# EAGLE design esp8266mosfet (EAGLE 7.5.0)
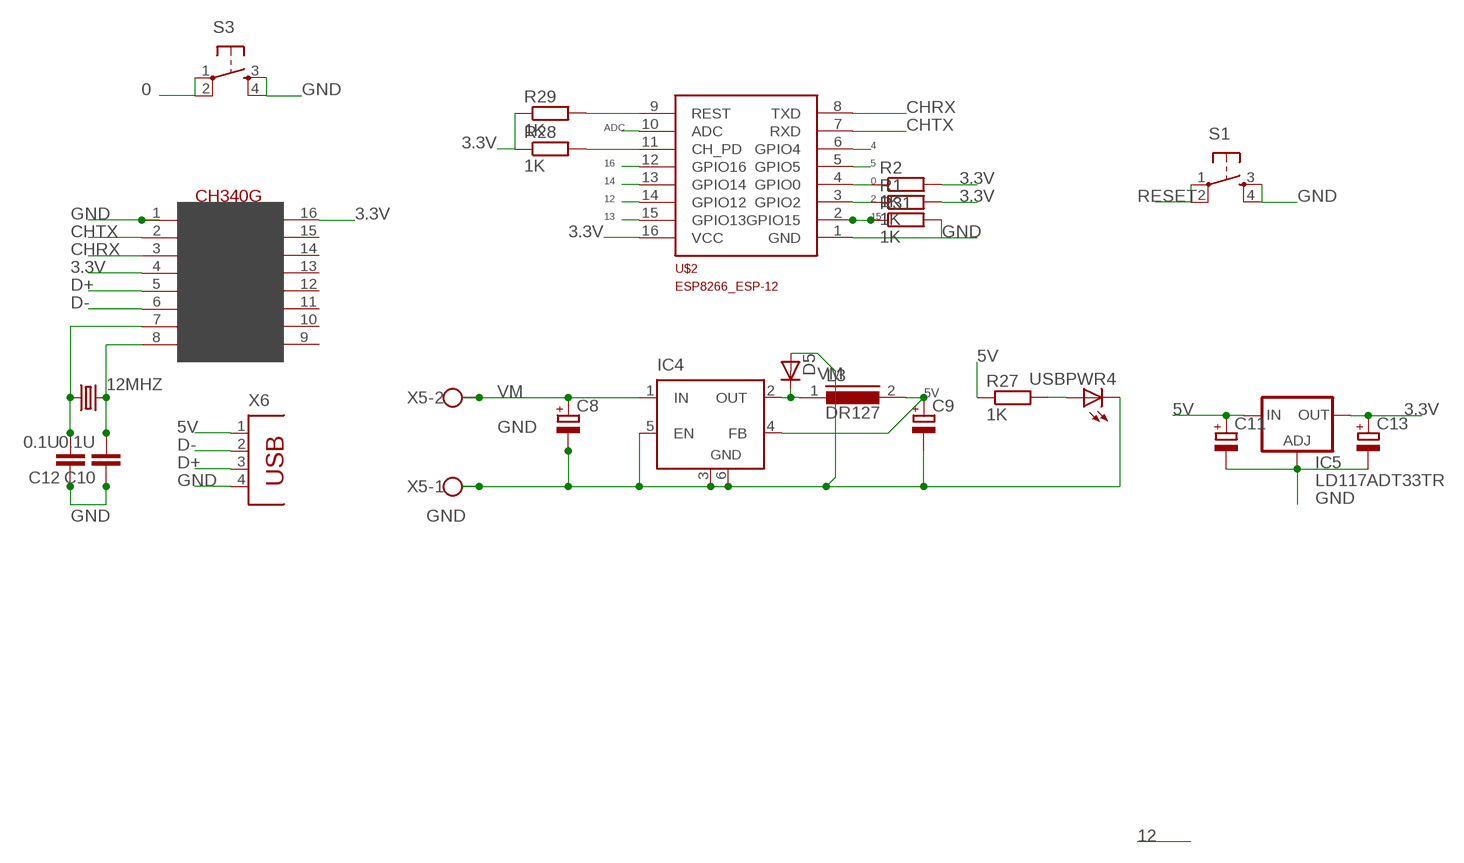
[diagram p0: schematic, sheet 1]

## Parts
12MHZ  CRYSTALHC49UP  [HC49UP]
C8  CPOL-EUE  [PANASONIC_E]
C9  CPOL-EUE  [PANASONIC_E]
C10  0.1U  C-EUC1206  [C1206]
C11  CPOL-EUC  [PANASONIC_C]
C12  0.1U  C-EUC1206  [C1206]
C13  CPOL-EUC  [PANASONIC_C]
D5  D-SOD-87  [SOD87]
IC4  LM2596S  [TO263-5]
IC5  LD117ADT33TR  [DPACK]
L3  DR127  [DR127]
R1  1K  R-EU_M1206  [M1206]
R2  1K  R-EU_M1206  [M1206]
R27  1K  R-EU_M1206  [M1206]
R28  1K  R-EU_M1206  [M1206]
R29  1K  R-EU_M1206  [M1206]
R31  1K  R-EU_M1206  [M1206]
S1  TAC_SWITCHPTH  [TACTILE-PTH]
S3  TAC_SWITCHPTH  [TACTILE-PTH]
U$2  ESP8266_ESP-12  [ESP8266-ESP12]
U$4  CH340G  [SOIC16]
USBPWR4  LED3MM  [LED3MM]
X5  W237-102  [W237-102]
X6  PN61729  [PN61729]

## Nets
0: R2.1 S3.1 S3.2 U$2.4(GPIO0)
2: R1.1 U$2.3(GPIO2)
3.3V: C13.+ IC5.4(OUT) R1.2 R2.2 R28.1 R29.1 U$2.16(VCC) U$4.4(V3) U$4.16(VCC)
4: U$2.6(GPIO4)
5: U$2.5(GPIO5)
5V: C9.+ C11.+ IC4.4(FB) IC5.3(IN) L3.2 R27.1 X6.1
12: U$2.14(GPIO12)
13: U$2.15(GPIO13)
14: U$2.13(GPIO14)
15: R31.1 U$2.2(GPIO15)
16: U$2.12(GPIO16)
ADC: U$2.10(ADC)
CHRX: U$2.8(TXD) U$4.3(RX)
CHTX: U$2.7(RXD) U$4.2(TX)
D+: U$4.5(D+) X6.3
D-: U$4.6(D-) X6.2
GND: C8.- C9.- C10.1 C11.- C12.1 C13.- D5.2(A) IC4.3(GND) IC4.5(EN) IC4.6(GND) IC5.1(ADJ) R31.2 S1.3 S1.4 S3.3 S3.4 U$2.1(GND) U$4.1(GND) USBPWR4.K(C) X5.1 X6.4
N$9: D5.1(C) IC4.2(OUT) L3.1
N$10: R27.2 USBPWR4.A
N$12: 12MHZ.1 C12.2 U$4.7(XI)
N$13: 12MHZ.2 C10.2 U$4.8(XO)
N$18: R28.2 U$2.11(CH_PD)
RESET: R29.2 S1.1 S1.2 U$2.9(REST)
VM: C8.+ IC4.1(IN) X5.2
Unconnected: U$4.9(CTS) U$4.10(DSR) U$4.11(RI) U$4.12(DCD) U$4.13(DTR) U$4.14(RTS) U$4.15(RS232)

## Library data of the parts
12MHZ = crystal:CRYSTAL: CRYSTAL; OC_FARNELL: unknown; OC_NEWARK: unknown
C8 C9 = resistor:CPOL-EU: POLARIZED CAPACITOR, European symbol
C10 C12 = rcl:C-EU: CAPACITOR, European symbol
C11 C13 = rcl:CPOL-EU: POLARIZED CAPACITOR, European symbol
D5 = semicon-smd-ipc:D-: DIODE unfilled
IC4 = linear:LM2596S: STEP-DOWN VOLTAGE REGULATOR
IC5 = v-reg:LD117A?*: Low drop fixed and adjustable positive voltage regulators 1 A Source: http://www.st.com/stonline/products/literature/ds/7194/ld1117axx.pdf
L3 = inductors:DR127: High Power Density, High Efficiency, Shielded Inductors Source: coiltronics_dr_series.pdf
R1 R2 R27-R29 R31 = rcl:R-EU_: RESISTOR, European symbol
S1 S3 = SparkFun:TAC_SWITCH: Momentary Switch Button commonly used for reset or general input. Spark Fun Electronics SKU : COM-00097
U$2 = ESP8266-ESP12:ESP8266_ESP-12: ESP8266 ESP-12 Discussion about pins here: http://www.esp8266.com/viewtopic.php?f=13&t=1429
U$4 = usb-serial:CH340G
USBPWR4 = RepRapjr:LED: LED OSRAM: - CHIPLED LG R971, LG N971, LY N971, LG Q971, LY Q971, LO R971, LY R971 LH N974, LH R974 LS Q976, LO Q976, LY Q976 LO Q996 - Hyper CHIPLED LW Q18S LB Q993, LB Q99A, LB R99A - SideLED LS A670, LO A670, LY A670, LG A670, LP A670 LB A673, LV A673, LT A673, LW A673 LH A674 LY A675 LS A676, LA A676, LO A676, LY A676, LW A676 LS A679, LY A679, LG A679 - Hyper Micro SIDELED® LS Y876, LA Y876, LO Y876, LY Y876 LT Y87S - SmartLED LW L88C, LW L88S LB L89C, LB L89S, LG L890 LS L89K, LO L89K, LY L89K LS L896, LA L896, LO L896, LY L896 - TOPLED LS T670, LO T670, LY T670, LG T670, LP T670 LSG T670, LSP T670, LSY T670, LOP T670, LYG T670 LG T671, LOG T671, LSG T671 LB T673, LV T673, LT T673, LW T673 LH T674 LS T676, LA T676, LO T676, LY T676, LB T676, LH T676, LSB T676, LW T676 LB T67C, LV T67C, LT T67C, LS T67K, LO T67K, LY T67K, LW E67C LS E67B, LA E67B, LO E67B, LY E67B, LB E67C, LV E67C, LT E67C LW T67C LS T679, LY T679, LG T679 LS T770, LO T770, LY T770, LG T770, LP T770 LB T773, LV T773, LT T773, LW T773 LH T774 LS E675, LA E675, LY E675, LS T675 LS T776, LA T776, LO T776, LY T776, LB T776 LHGB T686 LT T68C, LB T68C - Hyper Mini TOPLED® LB M676 - Mini TOPLED Santana® LG M470 LS M47K, LO M47K, LY M47K Source: http://www.osram.convergy.de LUXEON: - LUMILED® LXK2-PW12-R00, LXK2-PW12-S00, LXK2-PW14-U00, LXK2-PW14-V00 LXK2-PM12-R00, LXK2-PM12-S00, LXK2-PM14-U00 LXK2-PE12-Q00, LXK2-PE12-R00, LXK2-PE12-S00, LXK2-PE14-T00, LXK2-PE14-U00 LXK2-PB12-K00, LXK2-PB12-L00, LXK2-PB12-M00, LXK2-PB14-N00, LXK2-PB14-P00, LXK2-PB14-Q00 LXK2-PR12-L00, LXK2-PR12-M00, LXK2-PR14-Q00, LXK2-PR14-R00 LXK2-PD12-Q00, LXK2-PD12-R00, LXK2-PD12-S00 LXK2-PH12-R00, LXK2-PH12-S00 LXK2-PL12-P00, LXK2-PL12-Q00, LXK2-PL12-R00 Source: www.luxeon.com KINGBRIGHT: KA-3528ASYC Source: www.kingbright.com
X5 = con-wago-500:W237-102: WAGO SCREW CLAMP; MPN: 237-102; OC_FARNELL: unknown; OC_NEWARK: 70K9898
X6 = con-berg:PN61729: BERG USB connector; OC_FARNELL: unknown; OC_NEWARK: unknown

## Net classes
1 power: width 0.6 mm, clearance 0.305 mm

## Board
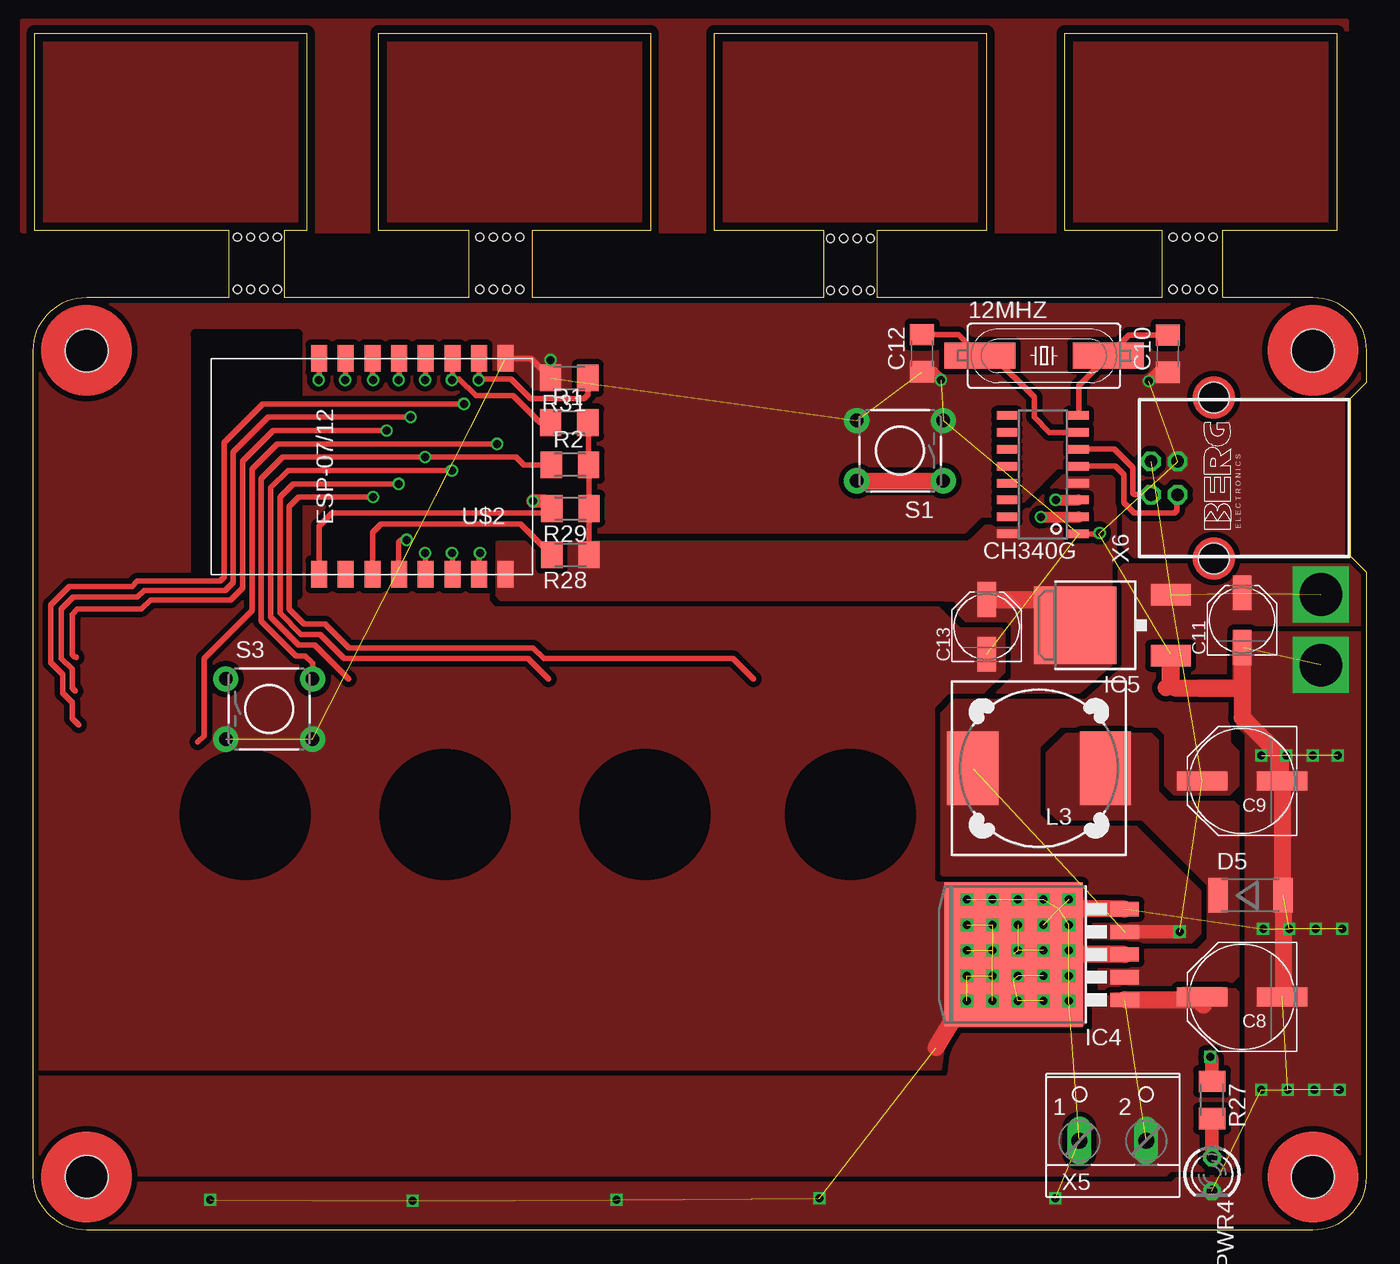
[diagram p1: board, top side]
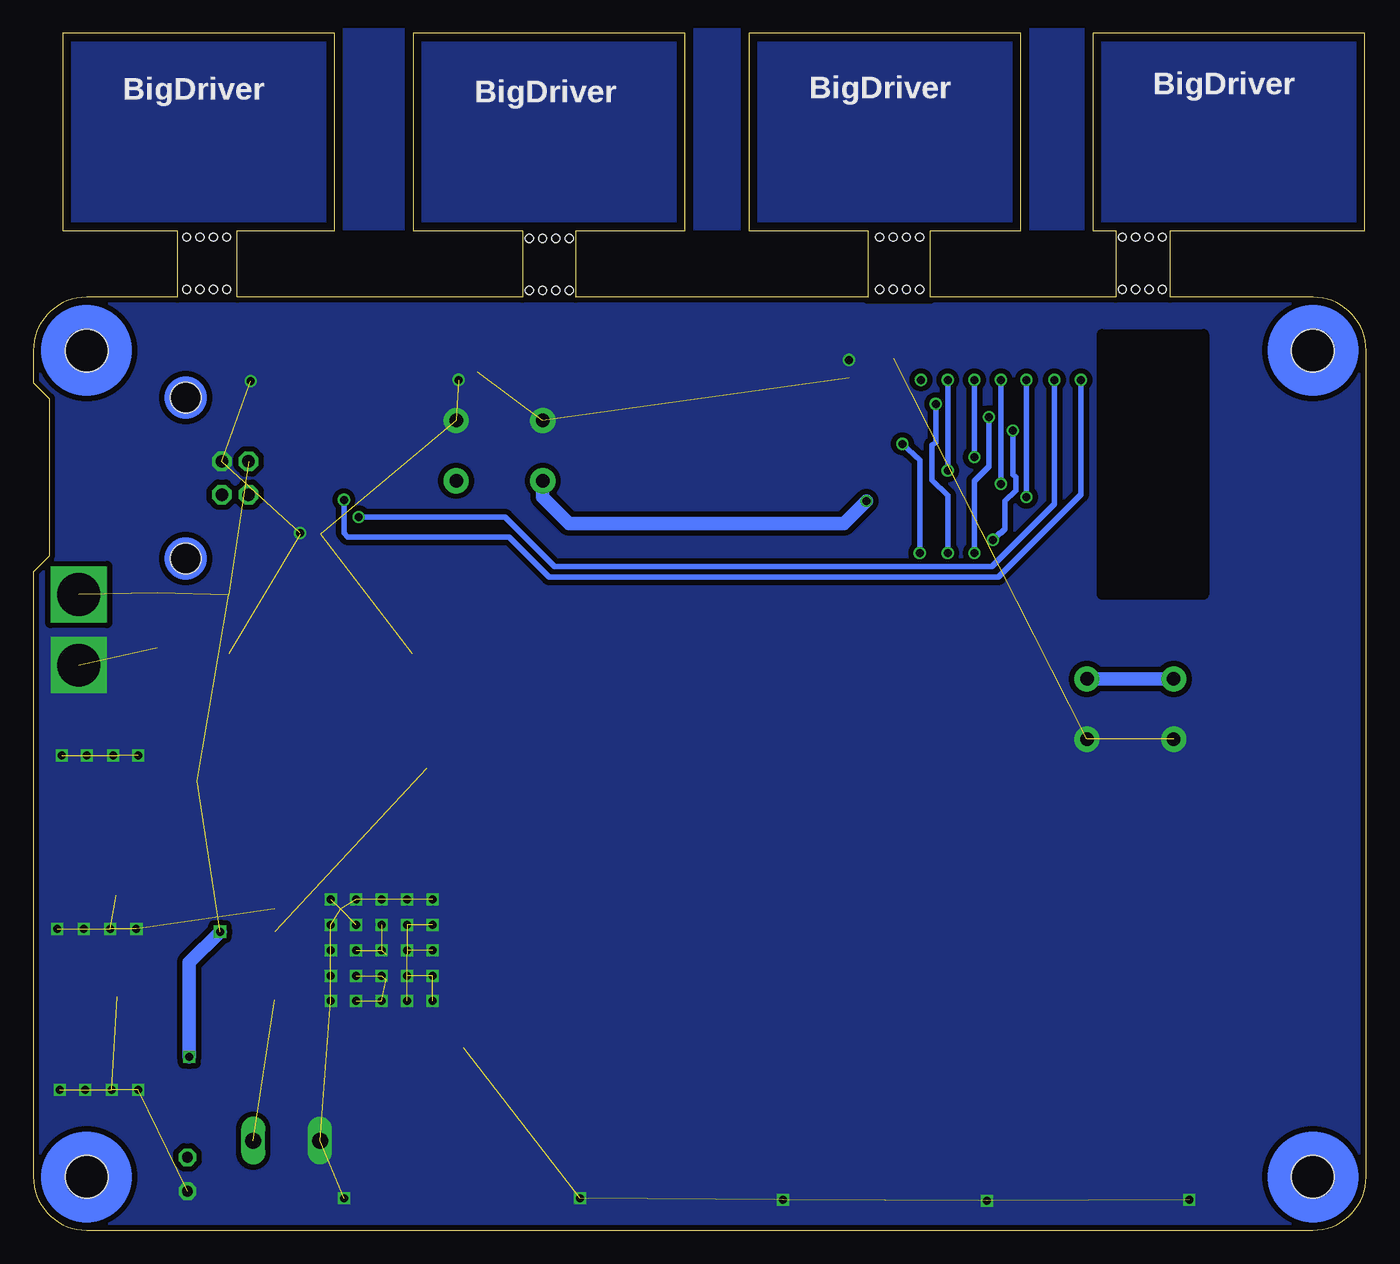
[diagram p2: board, bottom side, seen from below]

Size 100 x 89.8 mm. Coordinates in mm from the lower left corner, seen from the top.
Outline: 0,4 0,66 arc-90 4,70 14.7,70 14.7,75 0.1,75 0.1,89.8 20.5,89.8 20.5,75 18.8,75 18.8,70 32.7,70 32.7,75 25.9,75 25.9,89.8 46.3,89.8 46.3,75 37.4,75 37.4,70 59.3,70 59.3,75 51.1,75 51.1,89.8 71.5,89.8 71.5,75 63.3,75 63.3,70 84.7,70 84.7,75 77.4,75 77.4,89.8 97.8,89.8 97.8,75 89.2,75 89.2,70 96,70 arc-90 100,66 100,63.6 98.8,62.4 98.8,50.6 100,49.4 100,4 arc-90 96,0 4,0 arc-90 0,4
Copper layers (1*16): Top 0.035mm / dielectric 1.5mm / Bottom 0.035mm
Design rules "dirt_cheap_dirty_boards.v1": minimum track width 5mil, minimum drill 12mil, track to track 5mil, track to pad 5mil, pad to pad 5mil, via to via 5mil, smd to smd 0mil, copper to edge 10mil, drill to drill 10mil, minimum pad ring 10mil, minimum via ring 6mil, stop-mask expansion 2mil, vias tented up to drill 25mil, thermal gap 10mil
Holes 3.2 mm at 4,4 96,4 4,66 96,66
Holes 0.6 mm at 15.3,74.5 16.3,74.5 17.3,74.5 18.3,74.5 15.3,70.6 16.3,70.6 17.3,70.6 18.3,70.6 33.5,74.5 34.5,74.5 35.5,74.5 36.5,74.5 33.5,70.6 34.5,70.6 35.5,70.6 36.5,70.6 59.8,74.4 60.8,74.4 61.8,74.4 62.8,74.4 59.8,70.5 60.8,70.5 61.8,70.5 62.8,70.5 85.5,74.5 86.5,74.5 87.5,74.5 88.5,74.5 85.5,70.6 86.5,70.6 87.5,70.6 88.5,70.6
tRestrict: area 12.2,47.7 to 19.8,67.2; area 14.7,70 to 18.8,75; area 32.7,70 to 37.4,75; area 59.3,70 to 63.3,75; area 84.7,70 to 89.2,75; area -25.8,39.8 to -19.8,45.8; area 58.3,28.2 to 64.3,34.2; area 42.9,28.2 to 48.9,34.2; area 27.9,28.2 to 33.9,34.2; area 12.9,28.2 to 18.9,34.2
bRestrict: area 12.2,47.7 to 19.8,67.2; area 84.7,70 to 89.2,75; area 59.3,70 to 63.3,75; area 32.7,69.9 to 37.4,75; area 14.7,70 to 18.8,75

### Footprints (pad centres in the part's own frame; a part is rotated, then mirrored left to right if it is on the bottom)
HC49UP = smd 5.334 x 1.93: 1 -4.826,0; 2 4.826,0
PANASONIC_E = smd 3.8 x 1.4: + 3,0; - -3,0
C1206 = smd 1.6 x 1.8: 1 -1.4,0; 2 1.4,0
PANASONIC_C = smd 2.6 x 1.4: + 2.05,0; - -2.05,0
SOD87 = smd 1.45 x 2.6: 1 -2.445,0; 2 2.445,0
TO263-5 = smd 1.067 x 2.159: 1 -3.404,-5.791; 2 -1.702,-5.791; 3 0,-5.791; 4 1.702,-5.791; 5 3.404,-5.791 | smd 10.8 x 10.41: 6 0,2.54
DPACK = smd 1.6 x 3: 1 -2.28,-4.8; 3 2.28,-4.8 | smd 5.8 x 6.2: 4 0,2.38
DR127 = smd 3.85 x 5.5: 1 -4.975,0; 2 4.975,0
M1206 = smd 1.6 x 2: 1 -1.4,0; 2 1.4,0
TACTILE-PTH = drill 1.016 pad 1.88: 1 -3.251,2.261; 2 3.251,2.261; 3 -3.251,-2.261; 4 3.251,-2.261
ESP8266-ESP12 = smd 2 x 1.2: 1 16.2,2; 2 16.2,4; 3 16.2,6; 4 16.2,8; 5 16.2,10; 6 16.2,12; 7 16.2,14; 8 16.2,16; 9 0,16; 10 0,14; 11 0,12; 12 0,10; 13 0,8; 14 0,6; 15 0,4; 16 0,2
SOIC16 = smd 0.635 x 1.524: 1 -4.445,-2.695; 2 -3.175,-2.695; 3 -1.905,-2.695; 4 -0.635,-2.695; 5 0.635,-2.695; 6 1.905,-2.695; 7 3.175,-2.695; 8 4.445,-2.695; 9 4.445,2.695; 10 3.175,2.695; 11 1.905,2.695; 12 0.635,2.695; 13 -0.635,2.695; 14 -1.905,2.695; 15 -3.175,2.695; 16 -4.445,2.695
LED3MM = drill 0.813 octagon: A -1.27,0; K 1.27,0
W237-102 = drill 1.194 long: 1 -2.5,-1.27; 2 2.5,-1.27
PN61729 = drill 0.95 octagon: 1 1.25,4.71; 2 -1.25,4.71; 3 -1.25,2.71; 4 1.25,2.71 | hole 2.3: -6.02,0; 6.02,0

### Placement (x,y rotation side)
12MHZ  75.83,65.61 0 top
C8  90.69,17.51 180 top
C9  90.69,33.7 180 top
C10  85.12,65.76 90 top
C11  90.69,45.77 90 top
C12  66.67,65.8 90 top
C13  71.53,45.27 90 top
D5  91.33,25.13 0 top
IC4  76.09,20.68 90 top
IC5  80.53,45.38 90 top
L3  75.45,34.66 180 top
R1  40.21,60.6 0 top
R2  40.26,57.42 0 top
R27  88.43,9.77 270 top
R28  40.3,50.67 180 top
R29  40.3,54.14 180 top
R31  40.2,63.94 180 top
S1  65.03,58.48 180 top
S3  17.7,39.1 0 top
U$2  37.44,49.21 90 top
U$4  75.73,56.69 90 top
USBPWR4  88.43,4.19 270 top
X5  81,7.99 0 top
X6  88.57,56.43 90 top

### Tracks (layer width: path | path; a pad name or v marks a point on that pad's centre or on a via)
0  (via drill 0.6 pad 0.25)
  Top 0.406: S3.2 20.95,42.55 20.4,43.1 19.7,43.1 17.1,45.7 17.1,56.4 18.7,58 v29.4,58 36.2,58 36.8,57.4 38.83,57.4 R2.1 | U$2.4 29.44,63.84 v29.4,63.8
  Bottom 0.406: v29.4,63.8 v29.4,58
  Bottom 1.016: S3.1 S3.2
2  (via drill 0.6 pad 0.25)
  Top 0.406: 23.64,41.36 21.1,43.9 19.9,43.9 17.8,46 17.8,55.7 19.1,57 v31.4,57 | U$2.3 31.44,63.84 | 31.44,63.84 v31.4,63.8 | 31.44,63.84 31.96,63.84 33.2,62.6 36,62.6 38,60.6 R1.1
  Bottom 0.406: v31.4,63.8 v31.4,57
3.3V
  Top 0.406: 76.22,47.32 IC5.4 | R28.1 R29.1 41.7,57.38 R2.2 41.66,60.55 R1.2
  Top 1.27: C13.+ 76.22,47.32
  pour Top (isolate 0.406, rank 4, no thermals): 34.9,51.6 70.1,51.6 71.3,52.8 73.2,52.8 77,56.6 80.8,56.6 81.2,56.2 81.2,50 81,49.8 81,42.4 78.9,40.3 71.9,40.3 73.2,41.6 73.2,45.2 72.8,45.6 69.8,45.6 69.4,46 69.4,47 69.1,47.3 34.8,47.3 34.8,51.6
4  (via drill 0.6 pad 0.25)
  Top 0.406: 54.04,41.36 52.5,42.9 38.3,42.9 37.5,43.7 23.7,43.7 21.9,45.5 20.3,45.5 19.2,46.6 19.2,54.3 19.9,55 v25.5,55 | U$2.6 25.44,63.86 v25.5,63.8
  Bottom 0.406: v25.5,63.8 v25.5,55
5  (via drill 0.6 pad 0.25)
  Top 0.406: 38.64,41.36 37.1,42.9 23.3,42.9 21.5,44.7 20.1,44.7 18.5,46.3 18.5,55 19.5,56 v27.4,56 | U$2.5 27.44,63.84 v27.4,63.8
  Bottom 0.406: v27.4,63.8 v27.4,56
5V  (via drill 0.6 pad 0.25, 3.2)  (6 unrouted)
  Top 1.016: R27.1 88.43,12.87 v88.3,13 | v86,22.4 81.89,22.4 IC4.4
  Bottom 1.016: v88.3,13 88.3,20.1 v86,22.4
  other vias: 96.6,47.7
  pour Top (isolate 0.406, no thermals): 79.58,23.23 83.07,23.23 83.39,23.54 83.39,24.81 83.07,25.13 79.58,25.13 79.26,25.45 79.26,26.08 78.95,26.4 68.47,26.4 68.15,26.72 68.15,38.78 69.1,39.73 78.95,39.73 81.49,41.96 81.49,49.58 81.8,49.9 100,49.9 100,45.45 90.06,45.45 89.42,44.81 89.42,39.73 89.74,39.42 89.74,36.56 90.38,35.92 90.38,33.38 89.74,32.75 85.61,32.75 84.98,33.38 84.98,37.2 84.34,37.83 77.04,37.83 75.45,36.24 75.45,31.16 76.41,30.21 82.76,30.21 87.52,25.45 87.52,22.27 86.88,21.64 79.58,21.64
12  (via drill 0.6 pad 0.25)
  Top 0.406: 3.39,37.91 2.9,38.4 2.9,39.6 2.2,40.3 2.2,41.7 1.3,42.6 1.3,46.9 2.7,48.3 7.4,48.3 7.8,48.7 14,48.7 14.3,49 14.3,59.1 17.2,62 v32.3,62 | U$2.14 31.44,50.76 v31.4,50.8
  Bottom 0.406: v31.4,50.8 31.4,55.1 32.6,56.3 32.6,58.9 32.3,59.1 v32.3,62
13  (via drill 0.6 pad 0.25)
  Top 0.406: 12.34,36.64 12.8,37.1 12.8,42.9 16.4,46.5 16.4,57.1 18.3,59 v34.8,59 | U$2.15 33.44,50.74 v33.5,50.8
  Bottom 0.406: v33.5,50.8 33.5,57.8 v34.8,59
14  (via drill 0.6 pad 0.25)
  Top 0.406: 3.15,40.45 2.9,40.7 2.9,42.1 2.1,42.9 2.1,46.6 3,47.5 7.8,47.5 8.3,48 14.4,48 15,48.6 15,58.4 17.6,61 v28.3,61 | U$2.13 29.44,50.76 v29.4,50.8
  Bottom 0.406: v29.4,50.8 29.4,56.2 28.3,57.3 v28.3,61
15  (via drill 0.6 pad 0.25)
  Top 0.406: U$2.2 33.44,63.84 | 33.44,63.84 v33.4,63.8 | 33.44,63.84 35.86,63.84 37.3,62.4 41.3,62.4 41.6,62.7 R31.1
16  (via drill 0.6 pad 0.25)
  Top 0.406: 3.21,42.99 3.2,43 3.1,43 2.9,43.2 2.9,46.2 3.3,46.6 8.1,46.6 8.8,47.3 14.8,47.3 15.7,48.2 15.7,57.7 18,60 v26.5,60 | v28,51.8 27.6,51.8 27.4,51.6 27.4,49.25 U$2.12
  Bottom 0.406: v26.5,60 26.5,56.7 26.3,56.5 26.3,55.5 27.1,54.7 27.1,52.6 27.4,52.3 27.5,52.3 v28,51.8
CHRX  (via drill 0.6 pad 0.25)
  Top 0.406: U$2.8 21.44,63.84 v21.4,63.8
  Top 0.813: v76.7,54.8 78.41,54.8 U$4.3
  Bottom 0.406: v21.4,63.8 21.4,55.2 27.6,49 61.3,49 64.3,52 76.4,52 76.7,52.3 v76.7,54.8
CHTX  (via drill 0.6 pad 0.25)
  Top 0.406: U$2.7 23.44,63.94 23.4,63.9 v23.4,63.8
  Top 0.813: v75.6,53.5 78.42,53.5 U$4.2
  Bottom 0.406: v23.4,63.8 23.4,54.5 28.1,49.8 60.9,49.8 64.6,53.5 v75.6,53.5
D+
  Top 0.406: U$4.5 81.18,57.32 81.8,56.7 81.8,54.6 82.6,53.8 85.6,53.8 85.8,54 85.8,55.12 X6.3
D-
  Top 0.406: U$4.6 81.11,58.59 82.5,57.2 82.5,55.3 82.6,55.2 83.84,55.2 X6.2
GND  (via drill 0.6 pad 0.25, 3.2)  (56 unrouted)
  Top 0.406: U$4.1 79.94,52.24 v80,52.3 | U$2.1 37.34,65.41 R31.2 v38.8,65.3
  Top 0.813: C12.1 67.5,64.39 v68.1,63.8 | C10.1 84.36,64.36 v83.7,63.7
  Top 1.27: 84.98,40.69 85.3,41.01 85.3,43.27 IC5.1 85.33,40.97 85.61,40.69 90.38,40.69 90.69,41.01 C11.- 90.69,38.47 93.55,35.61 93.55,33.84 C9.- 93.69,25.21 D5.2 93.77,17.59 C8.- | IC4.6 73.55,18.78 | 67.73,13.7 71.96,20.68 IC4.6 | IC4.3 IC4.6 | IC4.5 76.95,24.09 IC4.6
  Bottom 0.406: v38.8,65.3 38.8,65.6
  other vias: 92.26,22.59 94.23,22.59 96.2,22.59 97.86,35.61 95.99,35.61 94.02,35.61 92.15,35.61 94.12,10.52 92.15,10.52 77.68,24.81 75.77,24.81 73.87,24.81 71.96,24.81 70.06,24.81 70.06,22.91 71.96,22.91 73.87,22.91 75.77,22.91 77.68,22.91 77.68,21 75.77,21 73.87,21 71.96,21 70.06,21 70.06,19.1 71.96,19.1 73.87,19.1 75.77,19.1 77.68,19.1 70.06,17.19 71.96,17.19 73.87,17.19 75.77,17.19 77.68,17.19 28.47,2.2 13.27,2.3 43.77,2.3 58.97,2.4 76.67,2.4 96.12,10.52 98.02,10.52 98.22,22.62 96.6,42.4
  pour Top (isolate 0.406, rank 2, no thermals): -0.95,12.11 68.05,12.11 68.47,15.29 78.63,15.29 78.95,15.61 78.95,25.77 78.63,26.08 68.02,26.08 67.7,26.4 67.7,39 68.9,40.2 71.1,40.2 72.8,41.9 72.8,44.9 72.6,45.1 69.5,45.1 67.9,46.7 34.6,46.7 34.1,47.2 34.1,51.8 34.7,52.4 69.9,52.4 71.1,53.6 73.2,53.6 76.8,57.2 81.3,57.2 81.8,56.7 81.8,51.3 82.6,50.5 98.8,50.5 99.9,51.6 99.9,67.3 97.4,69.8 1.8,69.8 0.4,68.4 0.4,45.1 -0.7,44 -0.95,26.08
  pour Bottom (isolate 0.406, rank 2, no thermals): 100,0 0,0 0,70 100,70
  pour Top (isolate 0.406, rank 5, no thermals): 90.99,4.27 90.97,4.27 90.7,4 85.6,4 85.2,3.6 0.1,3.6 0,3.7 0,0 100,0 100,45.13 88.79,45.13 87.52,43.86 87.52,40.05 89.74,40.05 90.06,39.73 90.06,38.15 91.01,37.2 91.01,4.49
  pour Top (isolate 0.61): -0.8,90.7 98.5,90.7 98.5,75 -0.8,75
  pour Bottom (isolate 0.61): -0.2,90 98.2,90 98.2,75.2 -0.2,75.2
N$9
  pour Top (isolate 0.406, rank 2, no thermals): 79.98,19.73 83.07,19.73 83.39,20.05 83.39,21.32 87.2,21.32 87.84,21.95 87.84,25.77 83.07,30.53 76.72,30.53 75.77,31.48 75.77,35.92 77.04,37.2 84.34,37.2 84.66,36.88 84.66,33.07 85.3,32.43 89.74,32.43 90.38,31.8 90.38,19.1 89.74,18.46 83.39,18.46 83.07,18.14 80,18.14 79.98,18.16
N$10
  Top 1.016: USBPWR4.A R27.2
N$12
  Top 0.406: C12.2 69.42,67.19 12MHZ.1 72,65.6 75.1,62.5 75.1,61 76.24,59.86 U$4.7
N$13
  Top 0.406: C10.2 82.21,67.16 12MHZ.2 78.43,63.38 U$4.8
N$18
  Top 0.406: U$2.11 25.44,52.34 26.1,53 36.57,53 R28.2
RESET  (via drill 0.6 pad 0.25)
  Top 0.406: U$2.9 21.44,52.84 22.4,53.8 38.56,53.8 R29.2
  Top 1.016: v37.5,54.7 38.34,54.7 R29.2
  Top 1.27: S1.2 S1.1
  Bottom 1.016: S1.2 61.8,55 59.82,53.02 39.18,53.02 v37.5,54.7
VM  (1 unrouted)
  Top 1.27: C8.+ 87.8,17.41 87.8,16.88 87.39,17.28 IC4.1
  pour Top (isolate 0.406, rank 3, no thermals): 79.58,17.83 85.61,17.83 85.93,18.14 90.06,18.14 90.38,17.83 90.38,5.13 89.74,4.49 85.3,4.49 84.98,4.17 -0.95,4.17 -0.95,11.48 68.37,11.48 69.74,15.61 79.58,15.61
(copper drawn outside any net)
  shapes: Bottom circle x6, Top circle x6

### Text on the board
bPlace: BigDriver | BigDriver | BigDriver | BigDriver
ohsilk: ENB | STEP | DIR | GND | ENB | STEP | DIR | GND | ENB | STEP | DIR | GND | ENB | STEP | DIR | GND | ENB | STEP | DIR | ENB | STEP | DIR | ENB | STEP | DIR | ENB | STEP | DIR | 12Mhz | 10K | 22P | 22P | 10K | 10K | 10K | CH340 | RESET | 10K | 5V | 100 | 100 | CH1 | CH2 | CH3 | CH4 | GND | 4050 | GPIO0 | GPIO2 | GPIO5 | GPIO4 | GPIO12 | GPIO14 | 220U | GPIO16 | GPIO13 | 10R | 10R | 10R | 10R | 10K | 10K | 10K | 10K | 220U | 2K2 | 2K2 | 2K2 | 2K2 | 2K2 | -CH1+ | -CH2+ | -CH3+ | -CH4+ | -PWR+